# EAGLE design capslocker (EAGLE 4.16)
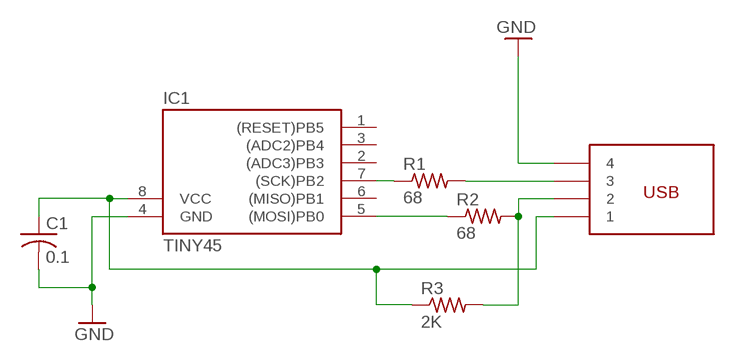
[diagram p0: schematic, sheet 1]

## Parts
C1  0.1  C-USC0805  [C0805]
IC1  TINY45  [SOIC8]
R1  68  R-US_R0603  [R0603]
R2  68  R-US_R0603  [R0603]
R3  2K  R-US_R0603  [R0603]
U$1  USB_A_EDGE  [USB_A_EDGE]

## Nets
GND: C1.2 IC1.4(GND) U$1.P$3
N$1: C1.1 IC1.8(VCC) R3.1 U$1.P$4
N$2: R1.2 U$1.P$1
N$3: R2.2 R3.2 U$1.P$2
N$4: IC1.7((SCK)PB2) R1.1
N$5: IC1.5((MOSI)PB0) R2.1
Unconnected: IC1.1((RESET)PB5) IC1.2((ADC3)PB3) IC1.3((ADC2)PB4) IC1.6((MISO)PB1)

## Library data of the parts
C1 = rcl:C-US: CAPACITOR, American symbol
IC1 = avr-4:TINY45: ATTiny45 8-lead SOIC8
R1-R3 = rcl:R-US_: RESISTOR, American symbol
U$1 = macetech:USB_A_EDGE

## Board
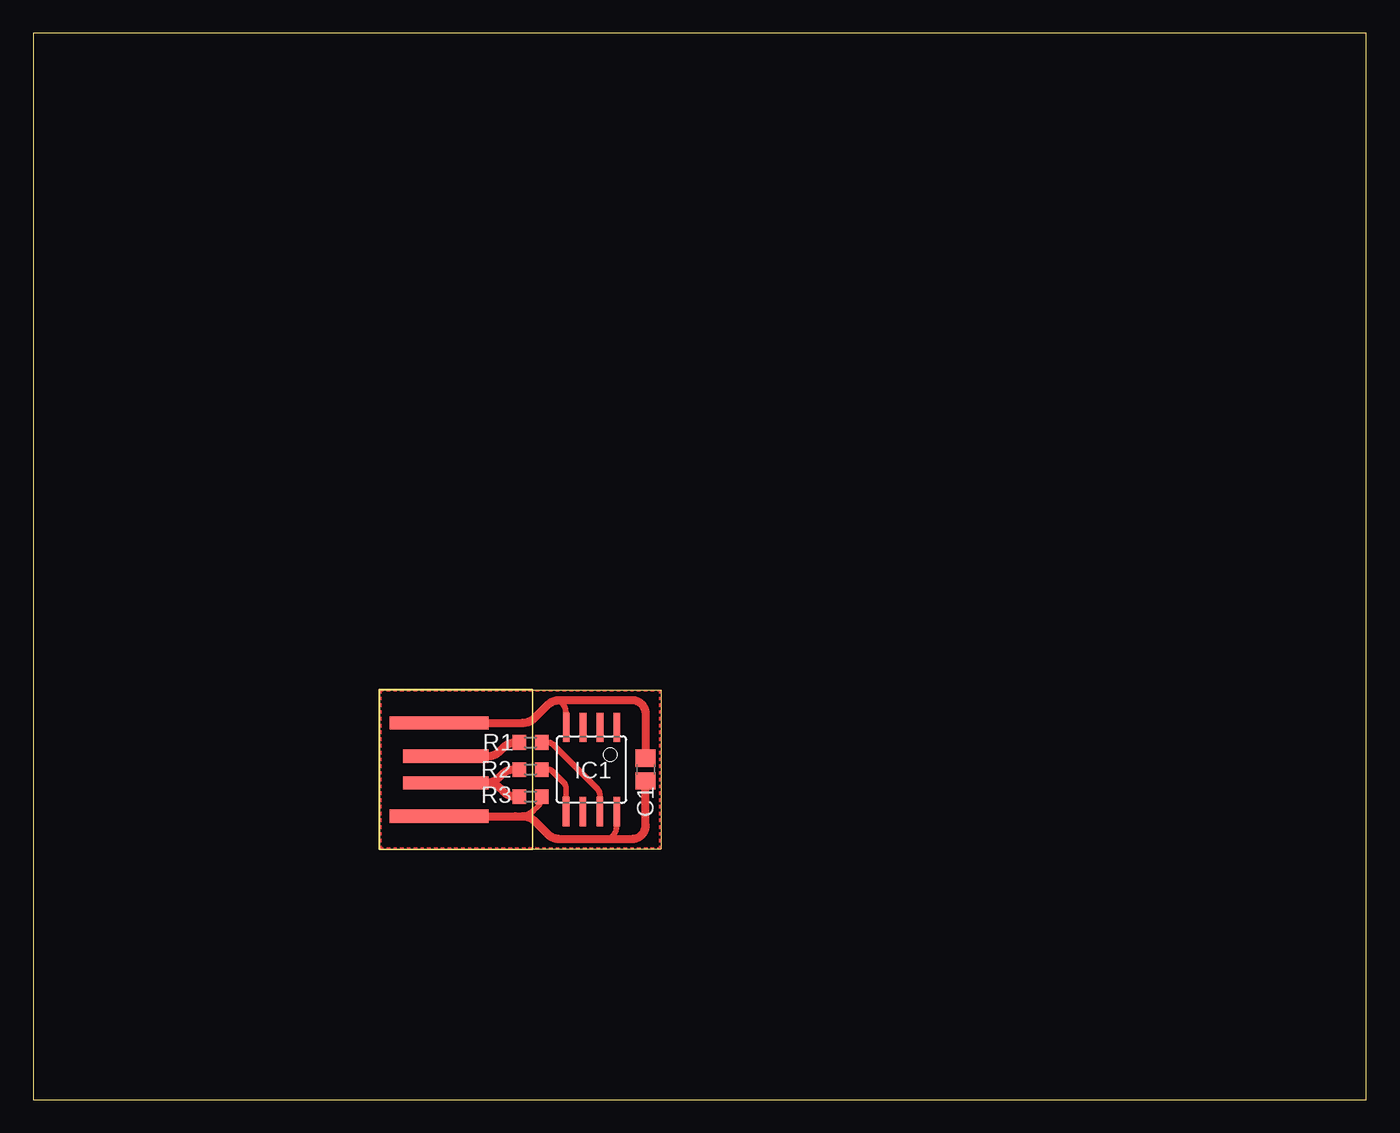
[diagram p1: board, top side]

Size 100 x 80 mm. Coordinates in mm from the lower left corner, seen from the top.
Outline: 0,0 100,0 100,80 0,80 0,0
Outline: 47.08,30.73 47.08,18.79 26,18.79 26,30.73 47.08,30.73
Copper layers (1*16): Top 0.035mm / dielectric 1.5mm / Bottom 0.035mm
Design rules "default": minimum track width 10mil, minimum drill 24mil, track to track 8mil, track to pad 8mil, pad to pad 8mil, via to via 8mil, smd to smd 8mil, copper to edge 40mil, drill to drill 8mil, minimum pad ring 10mil, minimum via ring 8mil, stop-mask expansion 4mil, vias tented up to drill 0mil, thermal gap 10mil

### Footprints (pad centres in the part's own frame; a part is rotated, then mirrored left to right if it is on the bottom)
C0805 = smd 1.3 x 1.5: 1 -0.85,0; 2 0.85,0
SOIC8 = smd 0.5 x 2.2: 1 -1.905,-3.154; 2 -0.645,-3.154; 3 0.625,-3.154; 4 1.895,-3.154; 5 1.905,3.154; 6 0.635,3.154; 7 -0.635,3.154; 8 -1.905,3.154
R0603 = smd 1 x 1.1: 1 -0.85,0; 2 0.85,0
USB_A_EDGE = smd 6.41 x 1: P$1 0,1; P$2 0,-1 | smd 7.41 x 1: P$3 -0.5,3.5; P$4 -0.5,-3.5

### Placement (x,y rotation side)
C1  45.94,24.76 90 top
IC1  41.87,24.76 180 top
R1  37.3,26.79 180 top
R2  37.3,24.76 180 top
R3  37.3,22.73 180 top
U$1  30.95,24.76 0 top

### Tracks (layer width: path | path; a pad name or v marks a point on that pad's centre or on a via)
GND
  Top 0.406: IC1.4 IC1.4 arc-45 39.97,27.93 39.97,28.95 arc45 39.59,29.85 39.48,29.97
  Top 0.61: U$1.P$3 36.72,28.26 arc45 37.62,28.63 38.58,29.59 arc-45 39.48,29.97 44.92,29.97 arc-90 45.94,28.95 C1.2
N$1
  Top 0.406: IC1.8 43.78,20.59 arc-45 43.41,19.69 43.27,19.55 | R3.1 arc-45 37.85,22.01 37.55,21.7 arc-45 36.65,21.33 36.16,21.33 36.16,21.26
  Top 0.61: U$1.P$4 36.16,21.26 36.72,21.26 arc-45 37.62,20.89 38.58,19.93 arc45 39.48,19.55 43.27,19.55 44.92,19.55 arc90 45.94,20.57 C1.1
N$2
  Top 0.61: U$1.P$1 34.09,25.76 arc45 34.99,26.13 35.28,26.42 arc-45 36.17,26.79 R1.2
N$3
  Top 0.61: U$1.P$2 33.74,23.76 | 33.74,23.76 34,23.76 arc45 34.89,24.13 35.15,24.39 arc-45 36.05,24.76 R2.2 | R3.2 36.17,22.73 arc-45 35.28,23.1 35,23.37 arc45 34.11,23.74 33.74,23.74 33.74,23.76
N$4
  Top 0.406: R1.1 38.64,26.79 arc-45 38.95,26.66 42.33,23.29 arc-45 42.51,22.86 IC1.7 42.51,21.58
N$5
  Top 0.406: R2.1 38.64,24.76 arc-45 38.95,24.63 39.79,23.8 arc-45 39.97,23.36 IC1.5 39.97,21.58
(copper drawn outside any net)
  shapes: Top area x132